# EAGLE design INSIDER02 (EAGLE 7.2.0)
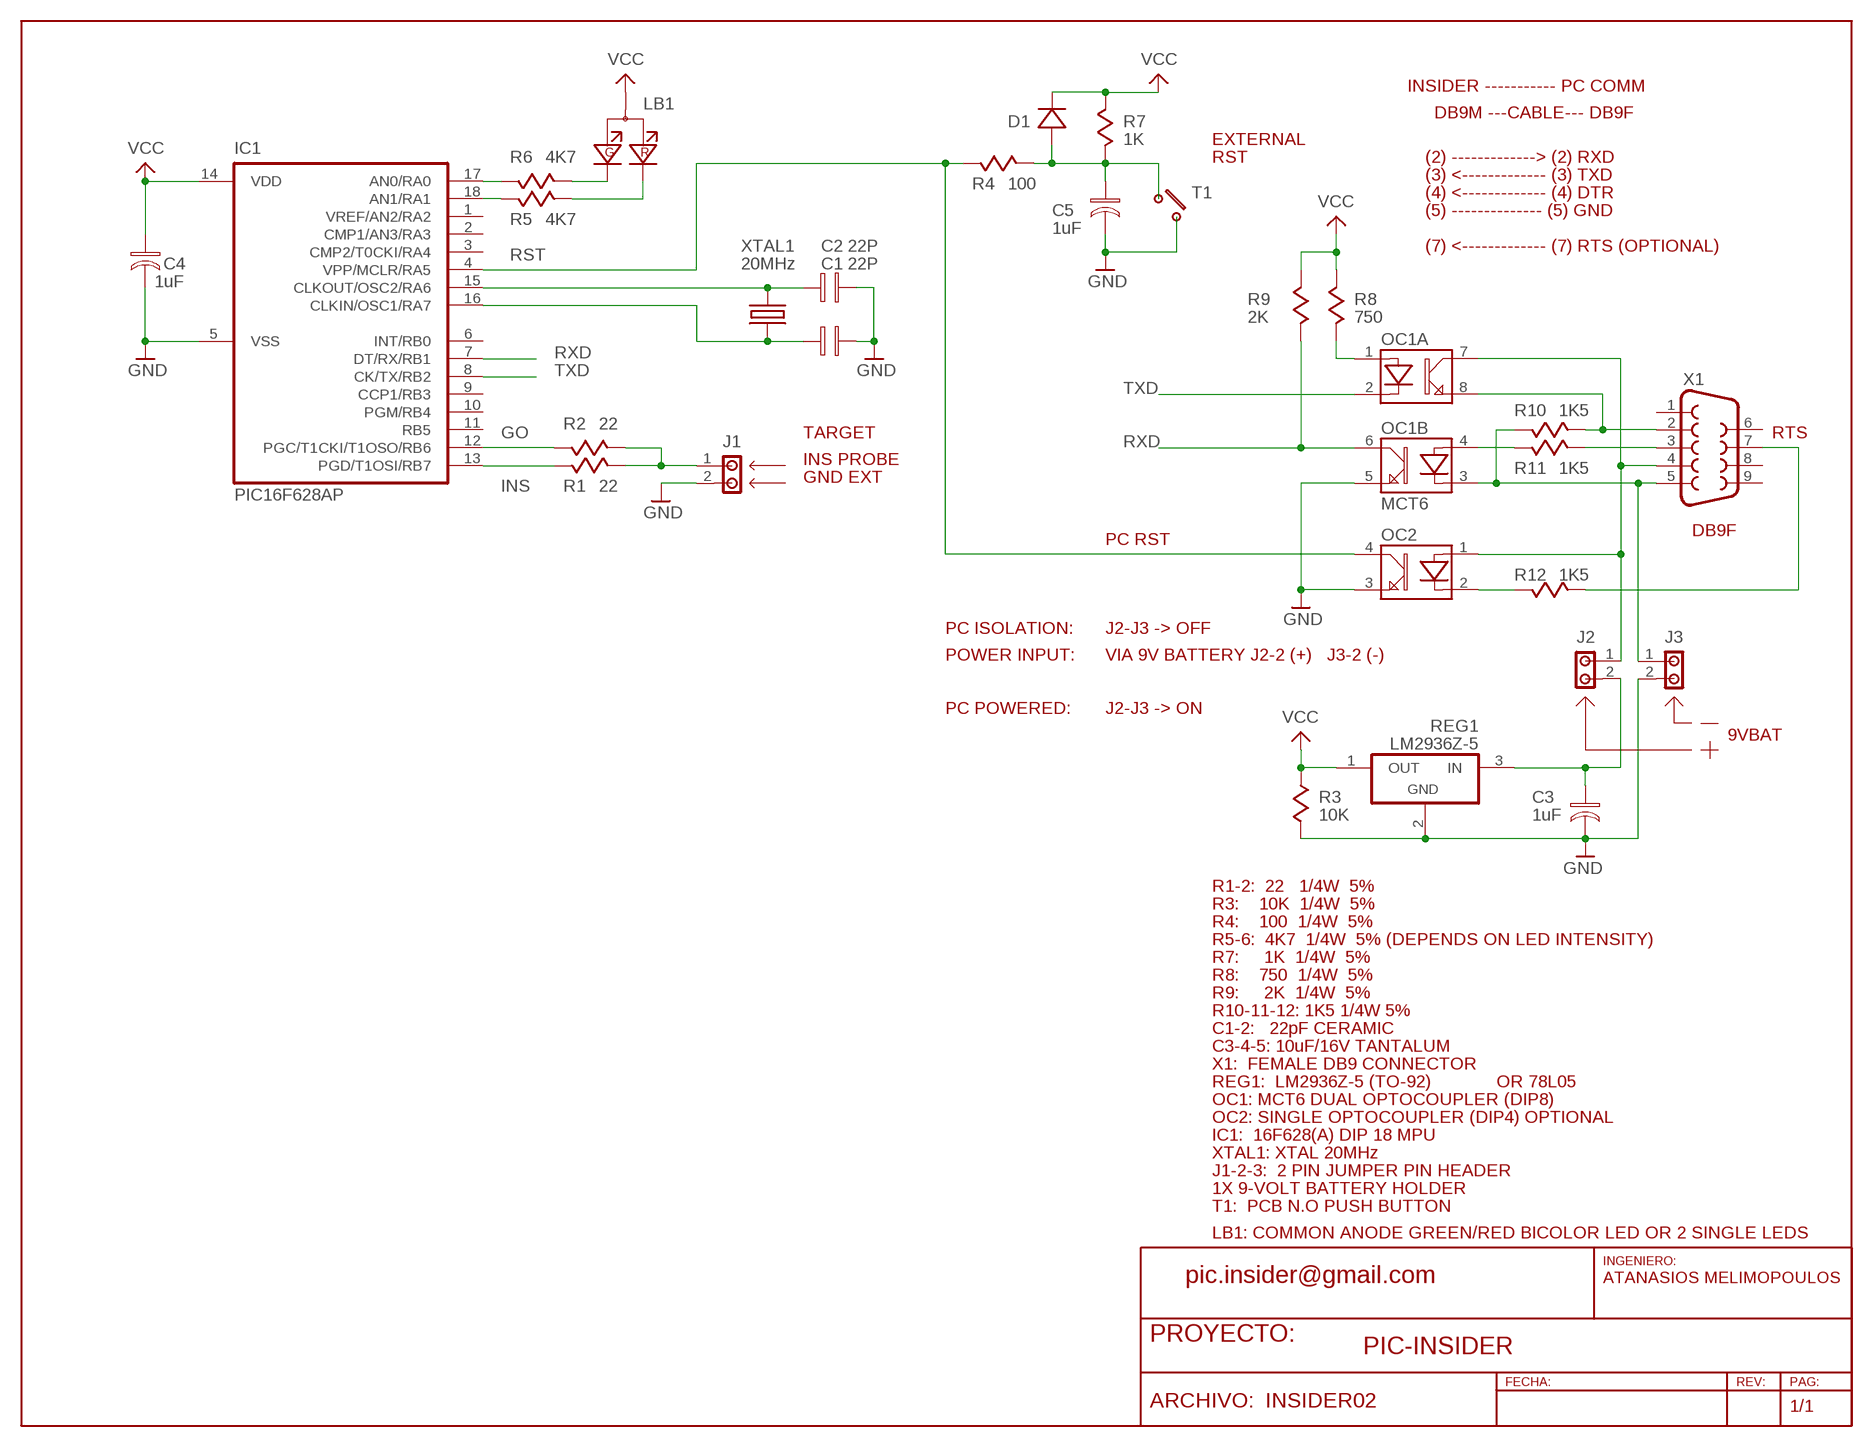
[diagram p0: schematic, sheet 1]

## Parts
C1  22P  CAP02  [C02]
C2  22P  CAP02  [C02]
C3  1uF  CAPE01  [CP01]
C4  1uF  CAPE01  [CP01]
C5  1uF  CAPE01  [CP01]
D1  1N4148  DIODE03  [D03]
IC1  PIC16F628AP  [DIL18]
J1  JMP2  [JP2]
J2  JMP2  [JP2]
J3  JMP2  [JP2]
LB1  LEDBIAC  [LEDBAC]
OC1  MCT6  OPTO2G  [DIL08]
OC2  OPTO1A  [DIL04]
R1  22  RES03  [R03]
R2  22  RES03  [R03]
R3  10K  RES03  [R03]
R4  100  RES03  [R03]
R5  4K7  RES03  [R03]
R6  4K7  RES03  [R03]
R7  1K  RES03  [R03]
R8  750  RES03  [R03]
R9  2K  RES03  [R03]
R10  1K5  RES03  [R03]
R11  1K5  RES03  [R03]
R12  1K5  RES03  [R03]
REG1  LM2936Z-5  78XXL  [TO92A]
T1  TEC3  [TEC3L]
X1  F09D  [F09D]
XTAL1  20MHz  XTALV300  [HC49V]

## Nets
GND: C1.P$2 C2.P$2 C3.P$2 C4.P$2 C5.P$2 IC1.5(VSS) J1.2 J3.2 OC1.5(B:E) OC2.3(E) R3.P$2 REG1.2(GND) T1.1
GO: IC1.12(PGC/T1CKI/T1OSO/RB6) R2.P$2
INS: IC1.13(PGD/T1OSI/RB7) R1.P$1
N$1: J3.1 OC1.3(B:K) R10.P$1 X1.5
N$2: OC1.8(A:E) R10.P$2 X1.2
N$3: J2.1 OC1.7(A:C) OC2.1(A) X1.4
N$4: R11.P$2 X1.3
N$5: OC1.4(B:A) R11.P$1
N$6: OC1.1(A:A) R8.P$2
N$8: OC2.2(K) R12.P$1
N$9: J1.1 R1.P$2 R2.P$1
N$10: C2.P$1 IC1.15(CLKOUT/OSC2/RA6) XTAL1.1
N$11: C1.P$1 IC1.16(CLKIN/OSC1/RA7) XTAL1.2
N$12: IC1.17(AN0/RA0) R6.P$2
N$14: LB1.G(K2) R6.P$1
N$15: LB1.R(K1) R5.P$1
N$16: IC1.18(AN1/RA1) R5.P$2
N$18: R12.P$2 X1.7
N$19: C5.P$1 D1.P$1(A) R4.P$1 R7.P$2 T1.4
N$20: C3.P$1 J2.2 REG1.3(IN)
RST: IC1.4(VPP/MCLR/RA5) OC2.4(C) R4.P$2
RXD: IC1.7(DT/RX/RB1) OC1.6(B:C) R9.P$2
TXD: IC1.8(CK/TX/RB2) OC1.2(A:K)
VCC: C4.P$1 D1.P$2(K) IC1.14(VDD) LB1.A R3.P$1 R7.P$1 R8.P$1 R9.P$1 REG1.1(OUT)
Unconnected: IC1.1(VREF/AN2/RA2) IC1.2(CMP1/AN3/RA3) IC1.3(CMP2/T0CKI/RA4) IC1.6(INT/RB0) IC1.9(CCP1/RB3) IC1.10(PGM/RB4) IC1.11(RB5) X1.1 X1.6 X1.8 X1.9

## Notes on the sheet
- INSIDER ----------- PC COMM
- DB9M ---CABLE--- DB9F
- EXTERNAL
- RST | (2) -------------> (2) RXD
- (3) <------------- (3) TXD
- (4) <------------- (4) DTR
- (5) -------------- (5) GND
- (7) <------------- (7) RTS (OPTIONAL)
- TARGET | RTS
- INS PROBE
- GND EXT
- DB9F
- PC RST
- PC ISOLATION: | J2-J3 -> OFF
- POWER INPUT: | VIA 9V BATTERY J2-2 (+)   J3-2 (-)
- PC POWERED: | J2-J3 -> ON
- 9VBAT
- R1-2:  22   1/4W  5%
- R3:    10K  1/4W  5%
- R4:    100  1/4W  5%
- R5-6:  4K7  1/4W  5% (DEPENDS ON LED INTENSITY)
- R7:     1K  1/4W  5%
- R8:    750  1/4W  5%
- R9:     2K  1/4W  5%
- R10-11-12: 1K5 1/4W 5%
- C1-2:   22pF CERAMIC
- C3-4-5: 10uF/16V TANTALUM
- X1:  FEMALE DB9 CONNECTOR
- REG1:  LM2936Z-5 (TO-92) | OR 78L05
- OC1: MCT6 DUAL OPTOCOUPLER (DIP8)
- OC2: SINGLE OPTOCOUPLER (DIP4) OPTIONAL
- IC1:  16F628(A) DIP 18 MPU
- XTAL1: XTAL 20MHz
- J1-2-3:  2 PIN JUMPER PIN HEADER
- 1X 9-VOLT BATTERY HOLDER
- T1:  PCB N.O PUSH BUTTON
- LB1: COMMON ANODE GREEN/RED BICOLOR LED OR 2 SINGLE LEDS
- pic.insider@gmail.com | ATANASIOS MELIMOPOULOS
- PIC-INSIDER

## Library data of the parts
C1 C2 = AtaLib:CAP: Capacitor
C3-C5 = AtaLib:CAPE: Capacitor Pol. Elect.
D1 = AtaLib:DIODE: DIODES
IC1 = AtaLib:PIC16F6*: PIC 16F627 - 628 - 648 family
J1-J3 = AtaLib:JMP2: Jumper 2xPin
LB1 = AtaLib:LEDBIAC: LED BIcolor AC 5mm
OC1 = AtaLib:OPTO2G: OPTOCOUPLER dual unit
OC2 = AtaLib:OPTO1A: OPTOCOUPLER simple
R1-R12 = AtaLib:RES: Resistor
REG1 = AtaLib:78XX: Positive Voltage Regulator
T1 = AtaLib:TEC: TECLAS INDIVIDUALES
X1 = AtaLib:F09: D-SUB 9 FEMALE
XTAL1 = AtaLib:XTALV300: Xtal Vert 300 mils

## Board
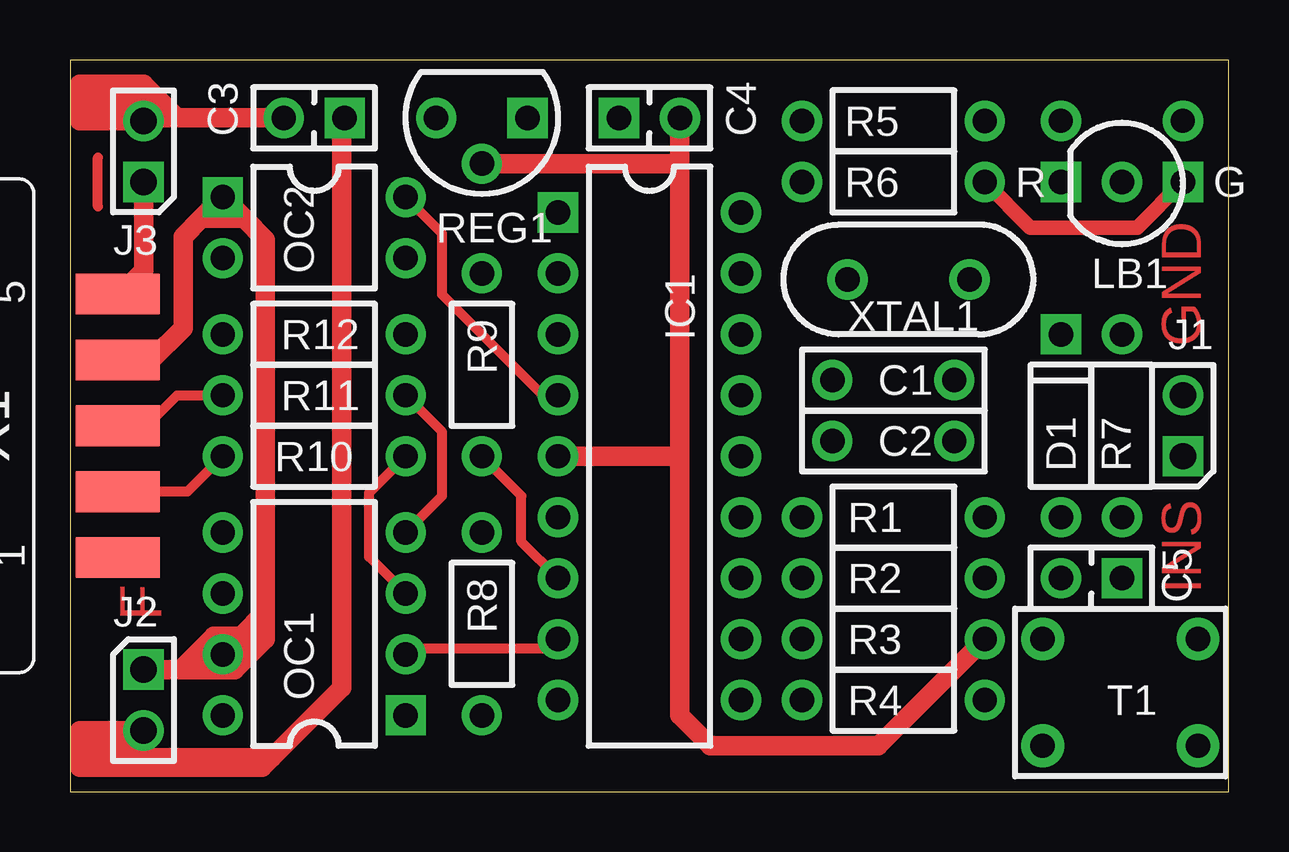
[diagram p1: board, top side]
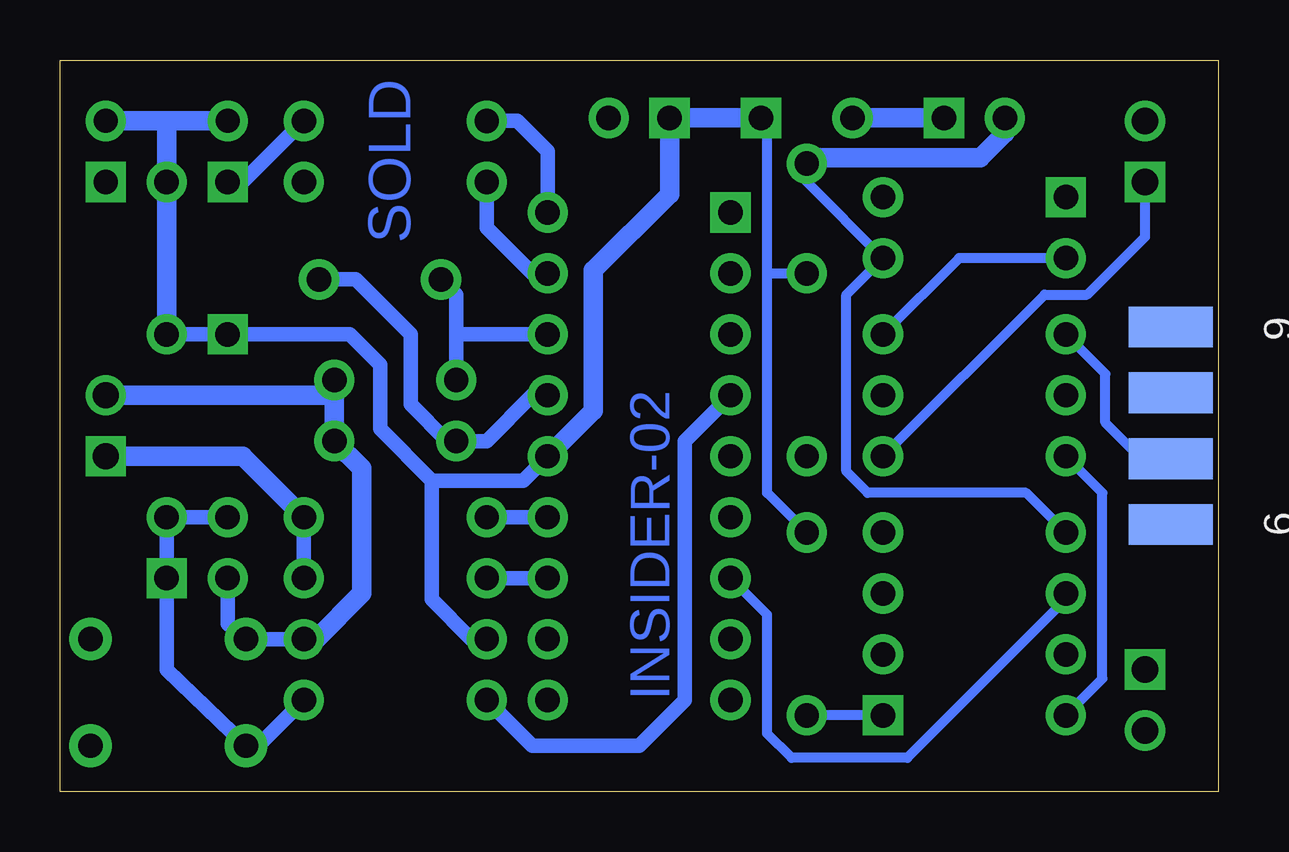
[diagram p2: board, bottom side, seen from below]

Size 48.26 x 30.48 mm. Coordinates in mm from the lower left corner, seen from the top.
Outline: 0,0 48.26,0 48.26,30.48 0,30.48 0,0
Copper layers (1*16): Top 0.035mm / dielectric 1.5mm / Bottom 0.035mm
Design rules "default": minimum track width 10mil, minimum drill 24mil, track to track 10mil, track to pad 10mil, pad to pad 10mil, via to via 10mil, smd to smd 8mil, copper to edge 25mil, drill to drill 10mil, minimum pad ring 10mil, minimum via ring 8mil, stop-mask expansion 8mil, vias tented up to drill 28mil, thermal gap 10mil

### Footprints (pad centres in the part's own frame; a part is rotated, then mirrored left to right if it is on the bottom)
C02 = drill 1.016 pad 1.676: P$1 -2.54,0; P$2 2.54,0
CP01 = drill 1.016 pad 1.676 square: P$1 -1.27,0 | drill 1.016 pad 1.676: P$2 1.27,0
D03 = drill 1.016 pad 1.676: P$1 -3.81,0 | drill 1.016 pad 1.676 square: P$2 3.81,0
DIL18 = drill 1.016 pad 1.676 square: 1 -10.16,-3.81 | drill 1.016 pad 1.676: 2 -7.62,-3.81; 3 -5.08,-3.81; 4 -2.54,-3.81; 5 0,-3.81; 6 2.54,-3.81; 7 5.08,-3.81; 8 7.62,-3.81; 9 10.16,-3.81; 10 10.16,3.81; 11 7.62,3.81; 12 5.08,3.81; 13 2.54,3.81; 14 0,3.81; 15 -2.54,3.81; 16 -5.08,3.81; 17 -7.62,3.81; 18 -10.16,3.81
JP2 = drill 1.1 pad 1.676 square: 1 0,1.27 | drill 1.1 pad 1.676: 2 0,-1.27
LEDBAC = drill 1.016 pad 1.676: A 0,0 | drill 1.016 pad 1.676 square: G 2.54,0; R -2.54,0
DIL08 = drill 1.016 pad 1.676 square: 1 -3.81,-3.81 | drill 1.016 pad 1.676: 2 -1.27,-3.81; 3 1.27,-3.81; 4 3.81,-3.81; 5 3.81,3.81; 6 1.27,3.81; 7 -1.27,3.81; 8 -3.81,3.81
DIL04 = drill 1.016 pad 1.676 square: 1 -1.27,-3.81 | drill 1.016 pad 1.676: 2 1.27,-3.81; 3 1.27,3.81; 4 -1.27,3.81
R03 = drill 1.016 pad 1.676: P$1 -3.81,0; P$2 3.81,0
TO92A = drill 1.016 pad 1.676 square: 1 -1.27,0 | drill 1.016 pad 1.676: 2 0.635,1.905; 3 2.54,0
TEC3L = drill 1.016 pad 1.778: 1 -2.667,2.54; 2 3.81,2.54; 3 3.81,-1.905; 4 -2.667,-1.905
F09D = smd 1.7 x 3.5: 1 -5.486,-6.045; 2 -2.743,-6.045; 3 0,-6.045; 4 2.743,-6.045; 5 5.486,-6.045 | smd 1.7 x 3.5 bottom: 6 -4.115,-6.045; 7 -1.372,-6.045; 8 1.372,-6.045; 9 4.115,-6.045
HC49V = drill 1.016 pad 1.676: 1 -2.54,0; 2 2.54,0

### Placement (x,y rotation side)
C1  34.29,17.14 0 top
C2  34.29,14.61 0 top
C3  10.16,28.07 180 top
C4  24.13,28.07 0 top
C5  42.55,8.89 180 top
D1  41.27,15.24 90 top
IC1  24.13,13.97 270 top
J1  46.35,15.24 180 top
J2  3.05,3.81 0 top
J3  3.05,26.67 180 top
LB1  43.81,25.4 0 top
OC1  10.16,6.99 90 top
OC2  10.16,23.5 270 top
R1  34.29,11.43 0 top
R2  34.29,8.89 180 top
R3  34.29,6.35 0 top
R4  34.29,3.81 180 top
R5  34.29,27.94 180 top
R6  34.29,25.4 180 top
R7  43.81,15.24 270 top
R8  17.14,6.99 270 top
R9  17.14,17.78 270 top
R10  10.16,13.97 180 top
R11  10.16,16.51 180 top
R12  10.16,19.05 180 top
REG1  17.78,28.07 180 top
T1  43.18,3.81 0 top
X1  -4.06,15.24 90 top
XTAL1  34.92,21.34 180 top

### Tracks (layer width: path | path; a pad name or v marks a point on that pad's centre or on a via)
GND
  Top 0.813: 25.4,26.16 25.4,13.97 | 25.4,26.16 C4.P$2 | 25.4,13.97 25.4,3.17 26.67,1.91 33.66,1.91 R3.P$2 | 25.4,13.97 IC1.5 | 0.38,28.7 0.38,27.94 J3.2 3.05,28.07 | 0.38,28.7 0.38,29.46 3.05,29.46 | 3.05,29.46 3.05,28.7 | 3.05,28.07 3.05,28.7 | 3.05,28.7 0.38,28.7 | 3.05,28.07 3.05,29.46 | REG1.2 25.4,26.16 | C3.P$2 4.45,28.07 | 4.45,28.07 3.05,28.07 | 4.45,28.07 3.05,29.46
  Bottom 0.406: REG1.2 17.14,25.4 OC2.3 15.49,20.7 15.49,13.34 14.61,12.45 8,12.45 OC1.5
  Bottom 0.61: R3.P$2 T1.1 41.27,6.99 C5.P$2
  Bottom 0.813: 36.83,16.51 C2.P$2 35.69,13.46 35.69,8.26 37.59,6.35 R3.P$2 | 36.83,16.51 C1.P$2 | REG1.2 16.89,26.42 9.91,26.42 8.89,27.43 C3.P$2 | 36.83,16.51 J1.2
GO
  Bottom 0.61: IC1.12 R2.P$2
INS
  Bottom 0.61: IC1.13 R1.P$1
N$1
  Top 0.406: OC1.3 12.45,9.78 12.45,12.45 R10.P$1
  Top 0.813: J3.1 3.05,21.72 2.06,20.73 X1.5
  Bottom 0.406: J3.1 3.05,23.11 5.46,20.7 7.24,20.7 R10.P$1
N$2
  Top 0.406: X1.2 4.88,12.5 R10.P$2
  Bottom 0.406: OC1.8 4.83,4.7 4.83,12.45 R10.P$2
N$3
  Top 0.813: J2.1 4.57,5.08 | 4.57,5.08 5.71,5.08 | 5.71,5.08 OC1.7 7.11,6.48 | 7.11,6.48 8.13,7.49 | X1.4 3.38,17.98 4.7,19.3 4.7,23.11 5.46,23.88 | 8.13,7.49 8.13,22.99 7.24,23.88 | 7.24,23.88 OC2.1 5.46,23.88 | 7.24,23.88 5.46,23.88 | 5.71,5.08 6.86,5.08 8.13,6.35 8.13,7.49 | 7.11,6.48 5.97,6.48 4.57,5.08
N$4
  Top 0.406: X1.3 3.17,15.24 4.45,16.51 R11.P$2
N$5
  Top 0.406: OC1.4 15.49,12.32 15.49,14.99 R11.P$1
N$6
  Bottom 0.406: OC1.1 R8.P$2
N$7
  Top 0.406: 1.14,24.38 1.14,26.42
N$8
  Bottom 0.406: OC2.2 10.79,22.23 R12.P$1
N$9
  Bottom 0.61: R2.P$1 R1.P$2
  Bottom 0.813: R1.P$2 40.64,13.97 J1.1
N$10
  Bottom 0.61: IC1.15 28.57,16.51 30.48,14.61 C2.P$1 32.13,14.61 33.66,16.13 33.66,19.05 35.94,21.34 XTAL1.1
N$11
  Bottom 0.61: C1.P$1 31.75,19.05 | 31.75,19.05 31.75,20.7 XTAL1.2 | 31.75,19.05 IC1.16
N$12
  Bottom 0.61: IC1.17 28.57,21.59 30.48,23.5 R6.P$2
N$14
  Top 0.61: R6.P$1 40.01,23.5 44.45,23.5 LB1.G
N$15
  Bottom 0.61: LB1.R 40.64,25.4 R5.P$1
N$16
  Bottom 0.61: IC1.18 27.94,26.67 29.21,27.94 R5.P$2
N$17  (via drill 1 pad 1.68)
  Bottom 0.813: v41.27,27.94 v46.35,27.94
N$18
  Bottom 0.406: X1.7 3.2,13.87 4.7,15.37 4.7,17.4 R12.P$2
N$19
  Bottom 0.61: D1.P$1 R7.P$2 C5.P$1 43.81,5.08 T1.4 40.01,1.91 R4.P$1
N$20
  Top 0.61: J2.2 3.05,1.52
  Top 0.813: 3.05,1.78 J2.2 | 3.05,1.78 3.05,1.52 3.05,1.4 | 3.05,1.4 3.05,1.02 2.92,1.02 | 2.92,1.02 0.38,1.02 0.38,1.78 | 0.38,1.78 0.38,2.54 J2.2 | 0.38,1.78 3.05,1.78 | J2.2 3.05,1.4 | 3.05,1.4 8.38,1.4 | 8.38,1.4 11.3,4.32 11.3,27.94 C3.P$1 | 2.92,1.02 8,1.02 8.38,1.4
  Bottom 0.813: C3.P$1 REG1.3
RST
  Top 0.406: OC2.4 15.49,23.24 15.49,20.7 19.68,16.51 IC1.4
  Bottom 0.61: IC1.4 22.23,14.61 22.23,3.81 24.13,1.91 28.57,1.91 R4.P$2
RXD
  Top 0.406: R9.P$2 18.8,12.32 18.8,10.41 IC1.7
  Bottom 0.406: OC1.6 6.35,8 12.95,1.4 17.78,1.4 18.8,2.41 18.8,7.37 IC1.7
TXD
  Top 0.406: OC1.2 14.22,5.97 19.94,5.97 IC1.8
VCC
  Bottom 0.406: 18.8,21.59 18.8,12.45 R8.P$1 | 18.8,21.59 18.8,27.81 REG1.1 | 18.8,21.59 R9.P$1
  Bottom 0.61: 32.77,12.95 32.77,8 31.11,6.35 R3.P$1 | 32.77,12.95 28.96,12.95 IC1.14 | R7.P$1 D1.P$2 36.2,19.05 34.92,17.78 34.92,15.11 32.77,12.95
  Bottom 0.813: 43.81,27.94 LB1.A R7.P$1 | IC1.14 26.04,15.88 26.04,21.72 22.86,24.89 C4.P$1 REG1.1

### Text on the board
Top: GND | INS | F
Bottom: SOLD | INSIDER-02